# EasyEDA schematic 1-Schematic_ringmod.json
TITLE: Ringmodulator with DRY/WET pot; REV: 1.0; Date: 2025-07-04; Sheet: 1/1; Drawn By: Tilman; Company: TekNoiseLab
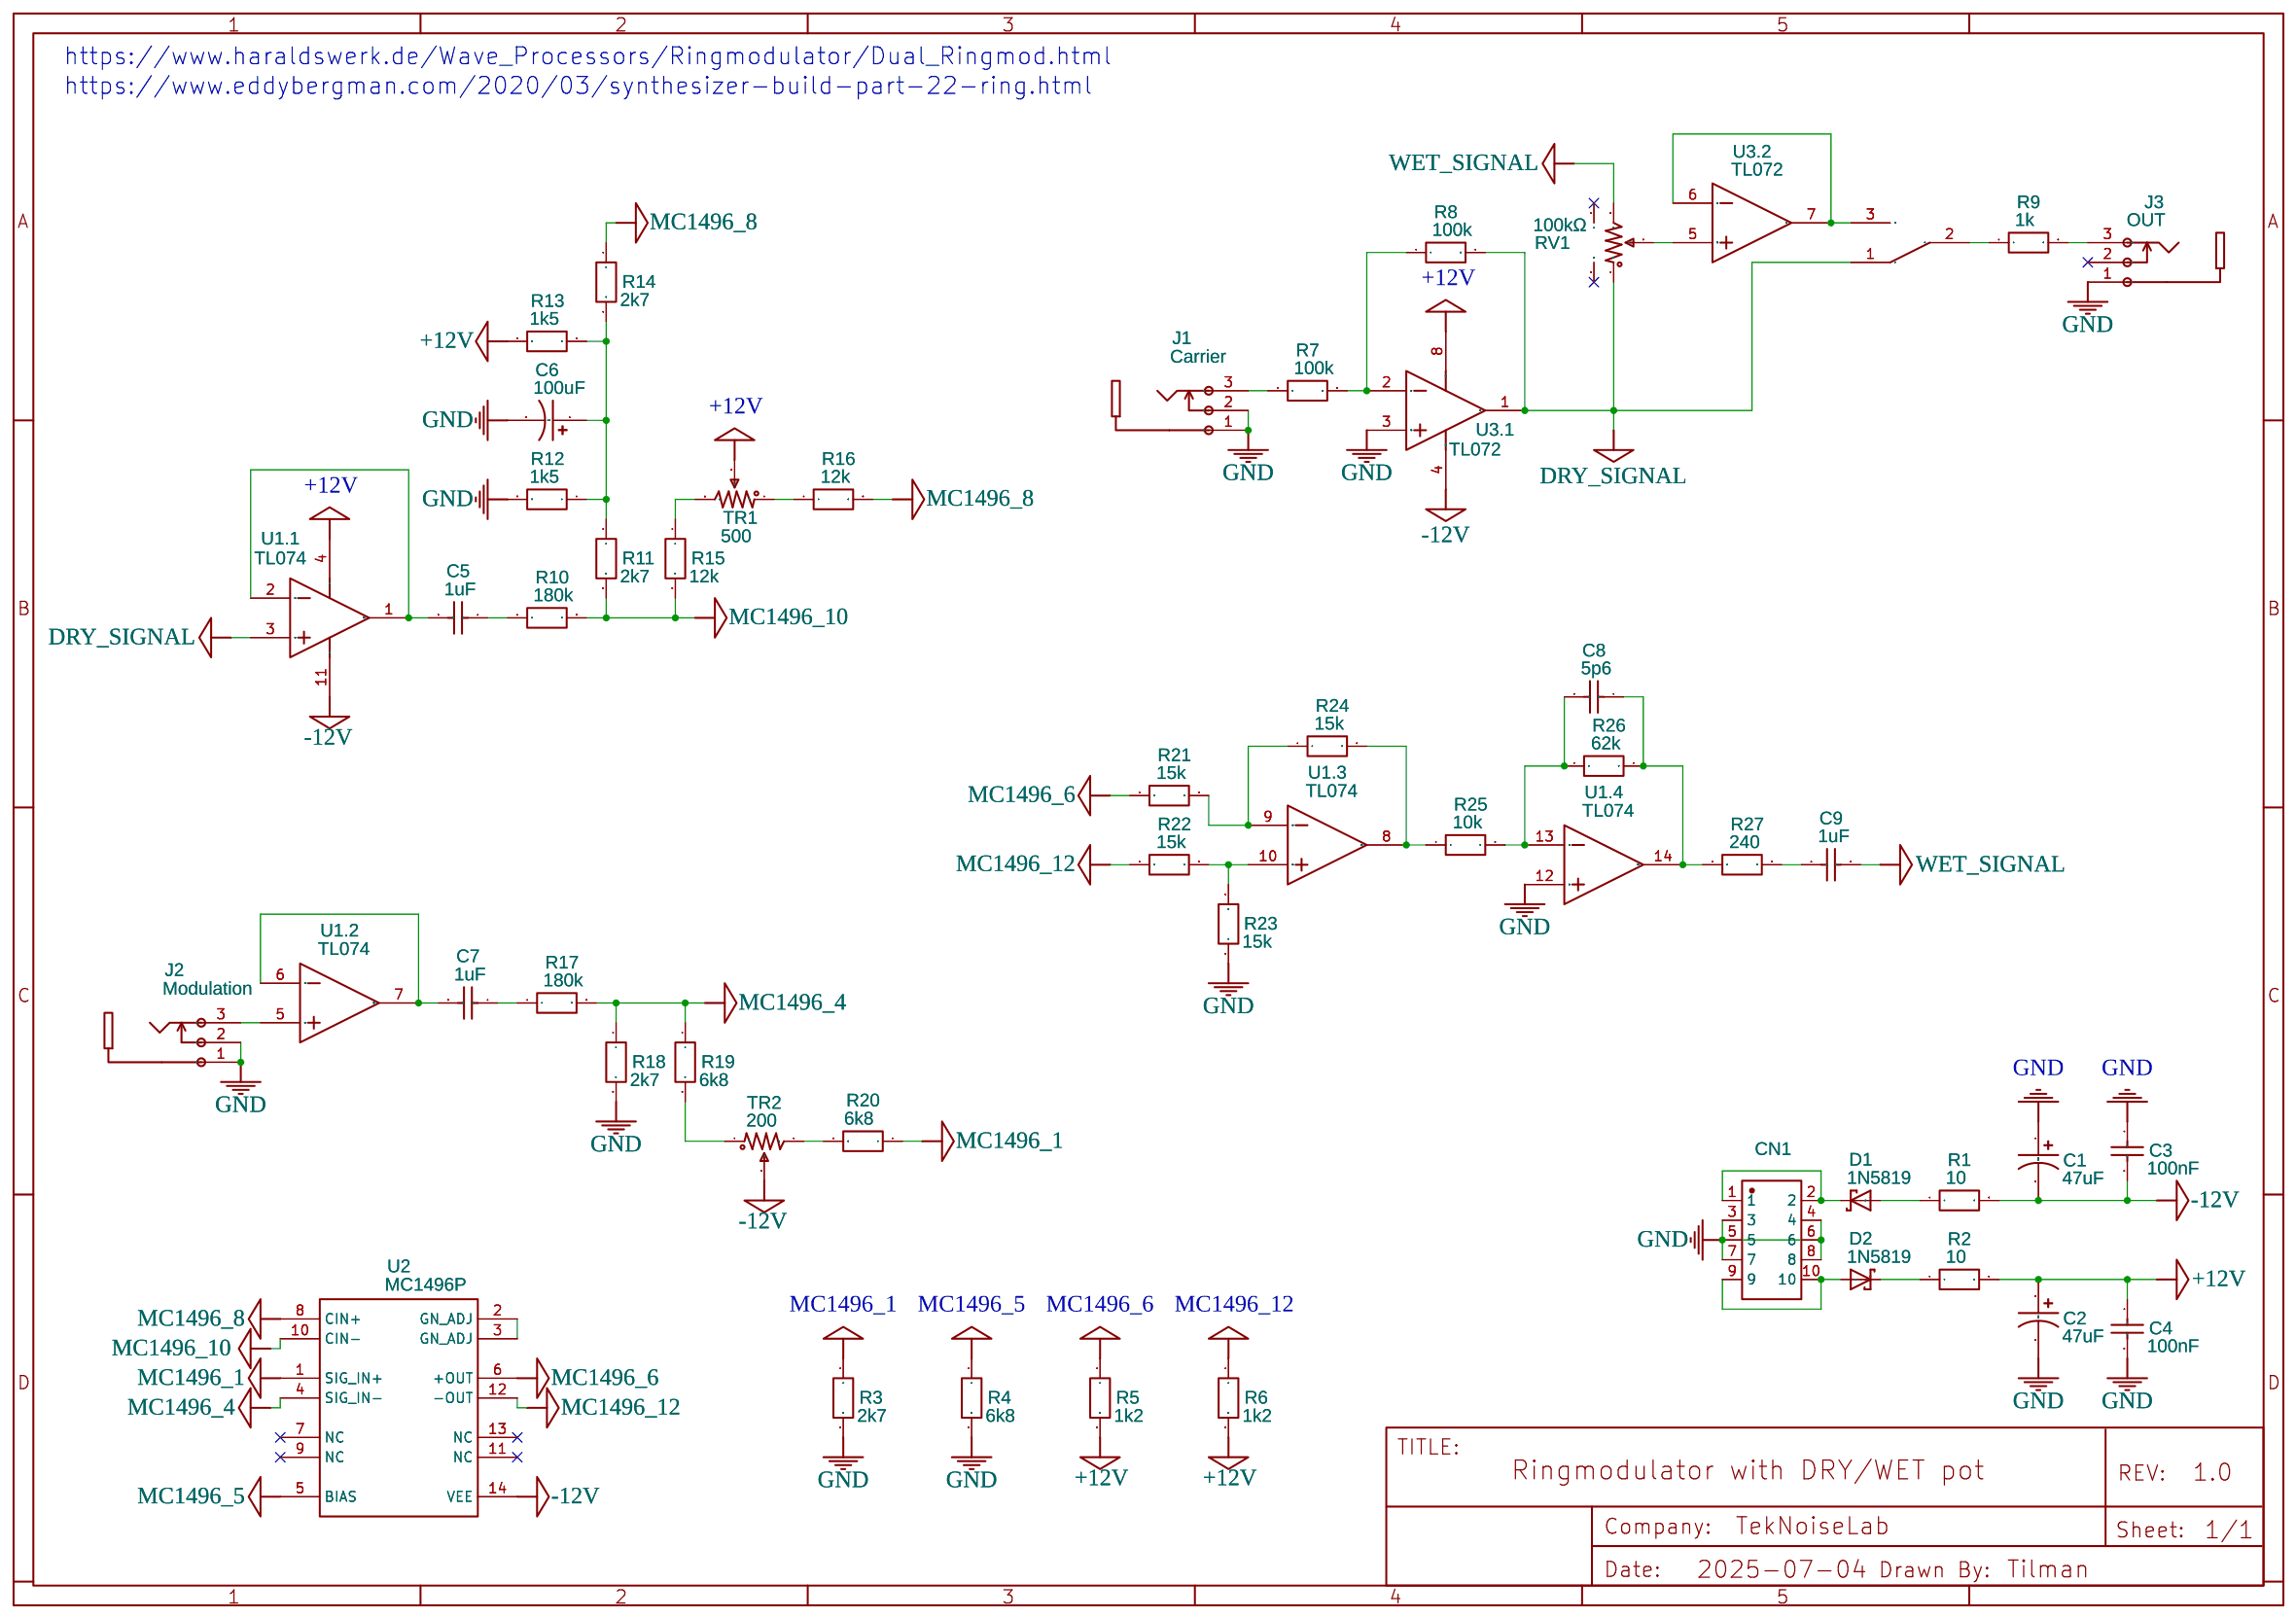
[diagram p0: schematic sheet]

## Parts
C1  47uF  [CAP-TH_BD5.0-P2.00-D0.5-FD]
C2  47uF  [CAP-TH_BD5.0-P2.00-D0.5-FD]
C3  100nF  [CAP-2.5*6.5*7.2]
C4  100nF  [CAP-2.5*6.5*7.2]
C5  1uF  [CAP-2.5*6.5*7.2]
C6  100uF  [CAP-TH_BD5.0-P2.00-D0.5-FD]
C7  1uF  [CAP-2.5*6.5*7.2]
C8  5p6  [CAP-2.5*6.5*7.2]
C9  1uF  [CAP-2.5*6.5*7.2]
CN1  DC3-2.54-10PAS  [CONN-TH_10P-P2.54_DC3-2.54-10PAS]
D1  1N5819  [DO41-7.6]
D2  1N5819  [DO41-7.6]
J1  Carrier  [PJ-301M_TIGHT2]
J2  Modulation  [PJ-301M_TIGHT2]
J3  OUT  [PJ-301M_TIGHT2]
R1  10  [RES-TH_BD2.4-L6.3-P10.30-D0.6]
R2  10  [RES-TH_BD2.4-L6.3-P10.30-D0.6]
R3  2k7  [RES-TH_BD2.4-L6.3-P10.30-D0.6]
R4  6k8  [RES-TH_BD2.4-L6.3-P10.30-D0.6]
R5  1k2  [RES-TH_BD2.4-L6.3-P10.30-D0.6]
R6  1k2  [RES-TH_BD2.4-L6.3-P10.30-D0.6]
R7  100k  [RES-TH_BD2.4-L6.3-P10.30-D0.6]
R8  100k  [RES-TH_BD2.4-L6.3-P10.30-D0.6]
R9  1k  [RES-TH_BD2.4-L6.3-P10.30-D0.6]
R10  180k  [RES-TH_BD2.4-L6.3-P10.30-D0.6]
R11  2k7  [RES-TH_BD2.4-L6.3-P10.30-D0.6]
R12  1k5  [RES-TH_BD2.4-L6.3-P10.30-D0.6]
R13  1k5  [RES-TH_BD2.4-L6.3-P10.30-D0.6]
R14  2k7  [RES-TH_BD2.4-L6.3-P10.30-D0.6]
R15  12k  [RES-TH_BD2.4-L6.3-P10.30-D0.6]
R16  12k  [RES-TH_BD2.4-L6.3-P10.30-D0.6]
R17  180k  [RES-TH_BD2.4-L6.3-P10.30-D0.6]
R18  2k7  [RES-TH_BD2.4-L6.3-P10.30-D0.6]
R19  6k8  [RES-TH_BD2.4-L6.3-P10.30-D0.6]
R20  6k8  [RES-TH_BD2.4-L6.3-P10.30-D0.6]
R21  15k  [RES-TH_BD2.4-L6.3-P10.30-D0.6]
R22  15k  [RES-TH_BD2.4-L6.3-P10.30-D0.6]
R23  15k  [RES-TH_BD2.4-L6.3-P10.30-D0.6]
R24  15k  [RES-TH_BD2.4-L6.3-P10.30-D0.6]
R25  10k  [RES-TH_BD2.4-L6.3-P10.30-D0.6]
R26  62k  [RES-TH_BD2.4-L6.3-P10.30-D0.6]
R27  240  [RES-TH_BD2.4-L6.3-P10.30-D0.6]
RV1  100kΩ  [RES-TH_RK09K1130AAU]
SW1  MTS102 TOGGLE SWITCH  [MTS102]
TR1  500  [RES-ADJ-TH_3P_L9.6-W4.8-P2.50-L]
TR2  200  [RES-ADJ-TH_3P_L9.6-W4.8-P2.50-L]
U1  TL074  [PDIP-14_L19.6-W6.5-P2.54-LS7.9-BL]  (sections 1,2,3,4)
U2  MC1496P  [DIP14]
U3  TL072  [PDIP-8_L9.6-W6.4-P2.54-LS7.9-BL]  (sections 1,2)

## Library data of the parts
C1 C2 C6 = 50MS710MEFCTZ5X7: Contributor: lcsc; Supplier: LCSC; Supplier Part: C5115261; Manufacturer: rubycon(红宝石)
C3-C5 C7-C9 = 0.22uF 5% 100VCalibration capacitor: Supplier Part: undefined; Supplier: LCSC; Manufacturer: ReliaPro
CN1 = DC3-2.54-10PAS: Contributor: lcsc; Supplier: LCSC; Supplier Part: C2977596; Manufacturer: ZHOURI(洲日); JLCPCB Part Class: Extended Part
D1 D2 = 1N5819-B: 1.0A SCHOTTKY BARRIER RECTIFIER
J1-J3 = PJ-301M_tight2: Supplier: Various; Supplier Part: PJ-301M; Contributor: Ed Random
R1-R27 = Res_AXIAL-0.4(1/4W)_US
RV1 = RK09K1130081: Supplier: LCSC; Supplier Part: C470311; Manufacturer: ALPSALPINE(阿尔卑斯阿尔派); JLCPCB Part Class: Extended Part; Contributor: lcsc
SW1 = MTS102 TOGGLE SWITCH: Supplier: ALIEXPRESS; Contributor: Bassman_1980
TR1 TR2 = CT-94EW503: Supplier: LCSC; Supplier Part: C2921732; Manufacturer: NIDEC(尼得科); JLCPCB Part Class: Extended Part; Contributor: lcsc
U1 = TL074ING4: subpart_no: 1; Supplier: LCSC; Supplier Part: C1347989; Manufacturer: TI(德州仪器); JLCPCB Part Class: Extended Part
U2 = MC1496P: Balanced ModulatorDemodulator
U3 = TL072IPE4: Supplier: LCSC; Supplier Part: C7069151; Manufacturer: TI(德州仪器); subpart_no: 1; JLCPCB Part Class: Extended Part

## Nets
+12V: C2.1 C4.1 R2.2 R5.2 R6.2 R13.2 TR1.2 U1.4(VCC+) U3.8(VCC+)
-12V: C1.2 C3.2 R1.2 TR2.2 U1.11(VCC-) U2.14(VEE) U3.4(VCC-)
GND: C1.1 C2.2 C3.1 C4.2 C6.2 CN1.3 CN1.4 CN1.5 CN1.6 CN1.7 CN1.8 J1.1 J1.2 J2.1 J2.2 J3.1 R3.2 R4.2 R12.2 R18.2 R23.2 U1.12(IN4+) U3.3(1IN+)
DRY_SIGNAL: R8.2 RV1.1 SW1.1 U1.3(IN1+) U3.1(1OUT)
MC1496_1: R3.1 R20.1 U2.1(SIG IN+)
MC1496_4: R17.2 R18.1 R19.1 U2.4(SIG IN-)
MC1496_5: R4.1 U2.5(BIAS)
MC1496_6: R5.1 R21.1 U2.6(+OUT)
MC1496_8: R14.1 R16.2 U2.8(CIN+)
MC1496_10: R10.2 R11.2 R15.2 U2.10(CIN-)
MC1496_12: R6.1 R22.1 U2.12(-OUT)
WET_SIGNAL: C9.1 RV1.3
Net-(C5-1): C5.1 R10.1
Net-(C5-2): C5.2 U1.1(OUT1) U1.2(IN1-)
Net-(C6-1): C6.1 R11.1 R12.1 R13.1 R14.2
Net-(C7-1): C7.1 R17.1
Net-(C7-2): C7.2 U1.6(IN2-) U1.7(OUT2)
Net-(C8-1): C8.1 R26.2 R27.1 U1.14(OUT4)
Net-(C8-2): C8.2 R25.2 R26.1 U1.13(IN4-)
Net-(C9-2): C9.2 R27.2
Net-(CN1-1): CN1.1 CN1.2 D1.C
Net-(CN1-9): CN1.9 CN1.10 D2.A
Net-(D1-A): D1.A R1.1
Net-(D2-C): D2.C R2.1
Net-(J1-3): J1.3 R7.1
Net-(J2-3): J2.3 U1.5(IN2+)
Net-(J3-3): J3.3 R9.2
Net-(R7-2): R7.2 R8.1 U3.2(1IN-)
Net-(R9-1): R9.1 SW1.2
Net-(R15-1): R15.1 TR1.3
Net-(R16-1): R16.1 TR1.1
Net-(R19-2): R19.2 TR2.1
Net-(R20-2): R20.2 TR2.3
Net-(R21-2): R21.2 R24.1 U1.9(IN3-)
Net-(R22-2): R22.2 R23.1 U1.10(IN3+)
Net-(R24-2): R24.2 R25.1 U1.8(OUT3)
Net-(RV1-2): RV1.2 U3.5(2IN+)
Net-(SW1-3): SW1.3 U3.6(2IN-) U3.7(2OUT)
Net-(U2-2): U2.2(GN ADJ) U2.3(GN ADJ)

Not connected (* = marked no-connect by the designer): J3 2*; RV1 4* 5*; U2 7(NC)* 9(NC)* 11(NC)* 13(NC)*

## Notes on the sheet
- https://www.haraldswerk.de/Wave_Processors/Ringmodulator/Dual_Ringmod.html
- https://www.eddybergman.com/2020/03/synthesizer-build-part-22-ring.html
